# Altium schematic sheet testboard_chip1_package.SchDoc
size E
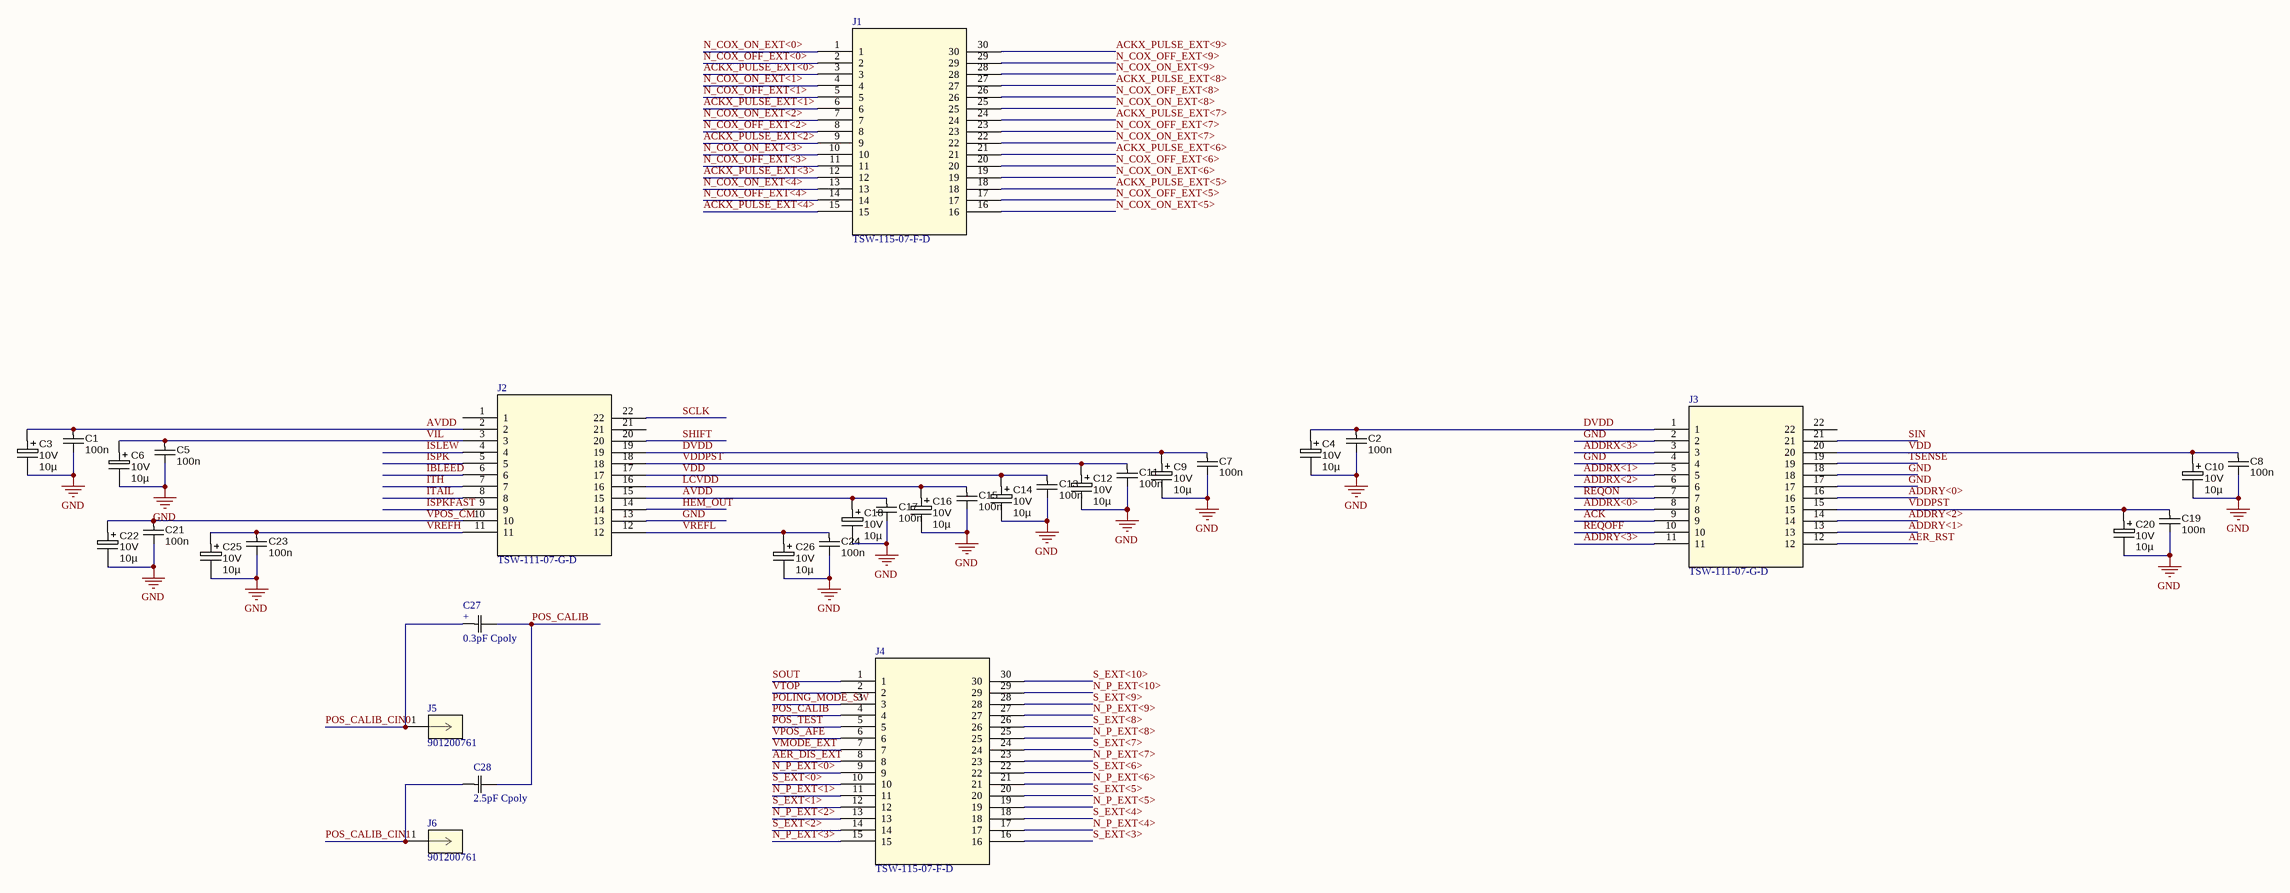
[diagram p0: testboard_chip1_package.SchDoc]

## Parts
C1  value 100n  [CAPC1608N]  (hidden comment: approved sub OK)
C2  value 100n  [CAPC1608N]  (hidden comment: approved sub OK)
C3  Ratings: 10V  [CAPMP2012X150USR]  (hidden comment: 10µ)
C4  Ratings: 10V  [CAPMP2012X150USR]  (hidden comment: 10µ)
C5  value 100n  [CAPC1608N]  (hidden comment: approved sub OK)
C6  Ratings: 10V  [CAPMP2012X150USR]  (hidden comment: 10µ)
C7  value 100n  [CAPC1608N]  (hidden comment: approved sub OK)
C8  value 100n  [CAPC1608N]  (hidden comment: approved sub OK)
C9  Ratings: 10V  [CAPMP2012X150USR]  (hidden comment: 10µ)
C10  Ratings: 10V  [CAPMP2012X150USR]  (hidden comment: 10µ)
C11  value 100n  [CAPC1608N]  (hidden comment: approved sub OK)
C12  Ratings: 10V  [CAPMP2012X150USR]  (hidden comment: 10µ)
C13  value 100n  [CAPC1608N]  (hidden comment: approved sub OK)
C14  Ratings: 10V  [CAPMP2012X150USR]  (hidden comment: 10µ)
C15  value 100n  [CAPC1608N]  (hidden comment: approved sub OK)
C16  Ratings: 10V  [CAPMP2012X150USR]  (hidden comment: 10µ)
C17  value 100n  [CAPC1608N]  (hidden comment: approved sub OK)
C18  Ratings: 10V  [CAPMP2012X150USR]  (hidden comment: 10µ)
C19  value 100n  [CAPC1608N]  (hidden comment: approved sub OK)
C20  Ratings: 10V  [CAPMP2012X150USR]  (hidden comment: 10µ)
C21  value 100n  [CAPC1608N]  (hidden comment: approved sub OK)
C22  Ratings: 10V  [CAPMP2012X150USR]  (hidden comment: 10µ)
C23  value 100n  [CAPC1608N]  (hidden comment: approved sub OK)
C24  value 100n  [CAPC1608N]  (hidden comment: approved sub OK)
C25  Ratings: 10V  [CAPMP2012X150USR]  (hidden comment: 10µ)
C26  Ratings: 10V  [CAPMP2012X150USR]  (hidden comment: 10µ)
C27  0.3pF Cpoly  [CAP_0603_AVX]
C28  2.5pF Cpoly  [CAPC17090_87N_KEM]
J1  TSW-115-07-F-D  [TSW-115-07-G-D_SAI]
J2  TSW-111-07-G-D  [TSW-111-07-G-D_SAI]
J3  TSW-111-07-G-D  [TSW-111-07-G-D_SAI]
J4  TSW-115-07-F-D  [TSW-115-07-G-D_SAI]
J5  901200761  [CONN_90120-0761_MOL]
J6  901200761  [CONN_90120-0761_MOL]

## Nets
GND: C1.2 C2.2 C3.2 C4.2 C5.2 C6.2 C7.2 C8.2 C9.2 C10.2 C11.2 C12.2 C13.2 C14.2 C15.2 C16.2 C17.2 C18.2 C19.2 C20.2 C21.2 C22.2 C23.2 C24.2 C25.2 C26.2 J2.13 J3.2 J3.4 J3.17 J3.18
ACK: J3.9
ACKX_PULSE_EXT<0>: J1.3
ACKX_PULSE_EXT<1>: J1.6
ACKX_PULSE_EXT<2>: J1.9
ACKX_PULSE_EXT<3>: J1.12
ACKX_PULSE_EXT<4>: J1.15
ACKX_PULSE_EXT<5>: J1.18
ACKX_PULSE_EXT<6>: J1.21
ACKX_PULSE_EXT<7>: J1.24
ACKX_PULSE_EXT<8>: J1.27
ACKX_PULSE_EXT<9>: J1.30
ADDRX<0>: J3.8
ADDRX<1>: J3.5
ADDRX<2>: J3.6
ADDRX<3>: J3.3
ADDRY<0>: J3.16
ADDRY<1>: J3.13
ADDRY<2>: J3.14
ADDRY<3>: J3.11
AER_DIS_EXT: J4.8
AER_RST: J3.12
AVDD: C1.1 C3.1 C17.1 C18.1 J2.2 J2.15
DVDD: C2.1 C4.1 C7.1 C9.1 J2.19 J3.1
HEM_OUT: J2.14
IBLEED: J2.6
ISLEW: J2.4
ISPK: J2.5
ISPKFAST: J2.9
ITAIL: J2.8
ITH: J2.7
LCVDD: C15.1 C16.1 J2.16
N_COX_OFF_EXT<0>: J1.2
N_COX_OFF_EXT<1>: J1.5
N_COX_OFF_EXT<2>: J1.8
N_COX_OFF_EXT<3>: J1.11
N_COX_OFF_EXT<4>: J1.14
N_COX_OFF_EXT<5>: J1.17
N_COX_OFF_EXT<6>: J1.20
N_COX_OFF_EXT<7>: J1.23
N_COX_OFF_EXT<8>: J1.26
N_COX_OFF_EXT<9>: J1.29
N_COX_ON_EXT<0>: J1.1
N_COX_ON_EXT<1>: J1.4
N_COX_ON_EXT<2>: J1.7
N_COX_ON_EXT<3>: J1.10
N_COX_ON_EXT<4>: J1.13
N_COX_ON_EXT<5>: J1.16
N_COX_ON_EXT<6>: J1.19
N_COX_ON_EXT<7>: J1.22
N_COX_ON_EXT<8>: J1.25
N_COX_ON_EXT<9>: J1.28
N_P_EXT<0>: J4.9
N_P_EXT<1>: J4.11
N_P_EXT<2>: J4.13
N_P_EXT<3>: J4.15
N_P_EXT<4>: J4.17
N_P_EXT<5>: J4.19
N_P_EXT<6>: J4.21
N_P_EXT<7>: J4.23
N_P_EXT<8>: J4.25
N_P_EXT<9>: J4.27
N_P_EXT<10>: J4.29
POLING_MODE_SW: J4.3
POS_CALIB: C27.2 C28.2 J4.4
POS_CALIB_CIN0: C27.1 J5.1
POS_CALIB_CIN1: C28.1 J6.1
POS_TEST: J4.5
REQOFF: J3.10
REQON: J3.7
S_EXT<0>: J4.10
S_EXT<1>: J4.12
S_EXT<2>: J4.14
S_EXT<3>: J4.16
S_EXT<4>: J4.18
S_EXT<5>: J4.20
S_EXT<6>: J4.22
S_EXT<7>: J4.24
S_EXT<8>: J4.26
S_EXT<9>: J4.28
S_EXT<10>: J4.30
SCLK: J2.22
SHIFT: J2.20
SIN: J3.21
SOUT: J4.1
TSENSE: J3.19
VDD: C8.1 C10.1 C13.1 C14.1 J2.17 J3.20
VDDPST: C11.1 C12.1 C19.1 C20.1 J2.18 J3.15
VIL: C5.1 C6.1 J2.3
VMODE_EXT: J4.7
VPOS_AFE: J4.6
VPOS_CM: C21.1 C22.1 J2.10
VREFH: C23.1 C25.1 J2.11
VREFL: C24.1 C26.1 J2.12
VTOP: J4.2

Not connected (* = marked no-connect by the designer): J2 1 21; J3 22

## Notes on the sheet
- (in symbol 06035J0R3PBSTR) +

## Library data of the parts
C1 C2 C5 C7 C8 C11 C13 C15 C17 C19 C21 C23 C24 = CAPC_100n_0603: Capacitor SMD Cer 100nF 10% 50V X7R 0603; Manufacturer 1: AVX Corporation; Manufacturer Part Number 1: 06035C104KAT2A; Ratings: 50V; X7R; Material: ceramic; Manufacturer 2: TDK Corporation; Manufacturer Part Number 2: C1608X7R1H104K; Package / Case: 0603 (1608 Metric); Tolerance: ±10%; Supplier 1: Digi-Key; Supplier Part Number 1: 478-5052-1-ND; ComponentLink1URL: http://www.avx.com/docs/Catalogs/cx7r.pdf; ComponentLink1Description: http://www.avx.com/docs/Catalogs/cx7r.pdf; Supplier 2: Digi-Key; Supplier Part Number 2: 445-1314-1-ND; ComponentLink2URL: http://product.tdk.com/capacitor/mlcc/en/documents/mlcc_commercial_general_en.pdf; ComponentLink2Description: http://product.tdk.com/capacitor/mlcc/en/documents/mlcc_commercial_general_en.pdf
C3 C4 C6 C9 C10 C12 C14 C16 C18 C20 C22 C25 C26 = CAPT_10u_0805_10V: Capacitor SMD Tantalum 10uF 20% 10V 0805; Manufacturer 1: AVX Corporation; Manufacturer Part Number 1: TAJP106M010RNJ; Package / Case: 0805 (2012 metric); Tolerance: ±20%; Material: Tantalum; Supplier 1: Digi-Key; Supplier Part Number 1: 478-3281-1-ND; Value: 10µ
C27 = 06035J0R3PBSTR: No Description Available; Mfr_Name: KYOCERA AVX; Type: DEV; Copyright: Copyright (C) 2022 Ultra Librarian. All rights reserved.; Manufacturer_Part_Number: 06035J0R3PBSTR; RefDes: RefDes
C28 = CBR06C259B5GAC: No Description Available; Mfr_Name: Kemet; Type: DEV; Copyright: Copyright (C) 2022 Ultra Librarian. All rights reserved.; Manufacturer_Part_Number: CBR06C259B5GAC; RefDes: RefDes
J1 J4 = TSW-115-07-F-D: No Description Available; Mfr_Name: Samtec Inc; Copyright: Copyright (C) 2022 Ultra Librarian. All rights reserved.; Manufacturer_Part_Number: TSW-115-07-F-D; RefDes: RefDes; Type: DEV
J2 J3 = TSW-111-07-G-D: No Description Available; Mfr_Name: Samtec Inc; Copyright: Copyright (C) 2022 Ultra Librarian. All rights reserved.; Manufacturer_Part_Number: TSW-111-07-G-D; RefDes: RefDes; Type: DEV
J5 J6 = 901200761: No Description Available; Mfr_Name: Molex Connector Corporation; Copyright: Copyright (C) 2022 Ultra Librarian. All rights reserved.; Manufacturer_Part_Number: 901200761; RefDes: RefDes; Type: DEV